# EAGLE design skullbadge_1.1 (EAGLE 5.10)
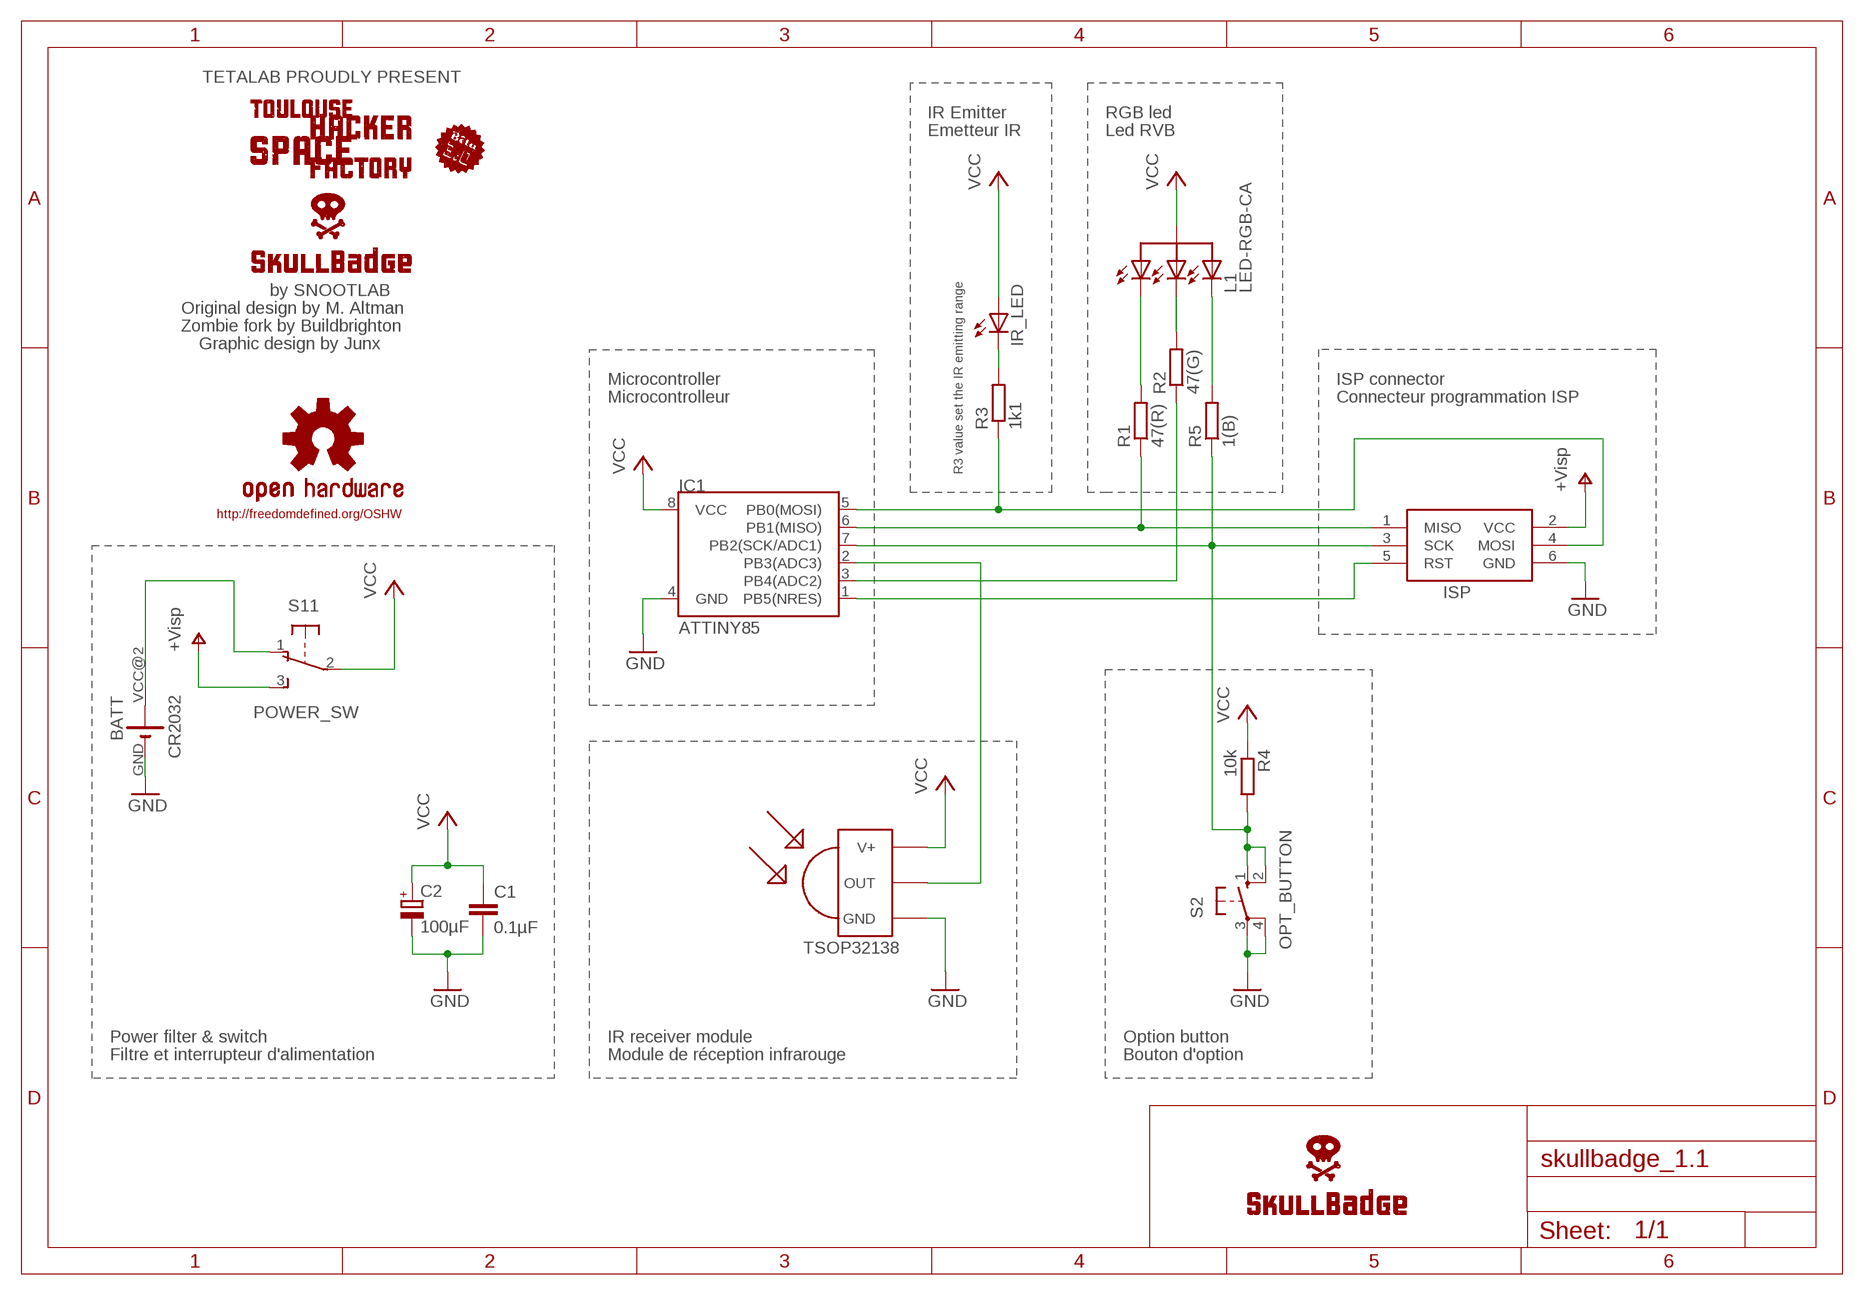
[diagram p0: schematic, sheet 1]

## Parts
BATT  CR2032  CR2032HCOMPACT  [BATT_CONN_CR2032]
C1  0.1µF  C-EU050-025X075  [C050-025X075]
C2  100µF  CPOL-EUE2-5  [E2-5]
IC1  ATTINY85  ATTINY25-45-85DIP08-LP  [DIL08-LP]
IR1  TSOPxxxxx  TSOP321/323/325  [TSOP321XX]
IR_LED  LED5MM_LP  [LED5MM_LP]
ISP  AVRISP-6  [AVRISP]
L1  LED-RGB-CA  LED-RGB-CA-EMS-5MM-BIS  [LED_RGB5MM_CA_DIFF_BIS]
R1  47(R)  R-EU_0207/7  [0207/7]
R2  47(G)  R-EU_0207/7  [0207/7]
R3  1k1  R-EU_0207/7  [0207/7]
R4  10k  R-EU_0207/7  [0207/7]
R5  1(B)  R-EU_0207/7  [0207/7]
S1  POWER_SW  SLIDING_SWITCH_SPDT-OS102011MA1QN1  [OS102011MA1QN1]
S2  OPT_BUTTON  10-XX  [B3F-10XX]
U$7  OSHW-LOGOL  [OSHW-LOGO-L]

## Nets
GND: BATT.GND(-) C1.2 C2.- IC1.4(GND) IR1.GND ISP.6(GND) S2.3(P) S2.4(P1)
MISO: IC1.6(PB1(MISO)) ISP.1(MISO) R1.1
MOSI: IC1.5(PB0(MOSI)) ISP.4(MOSI) R3.1
N$2: L1.RED_C R1.2
N$3: L1.GREEN_C R2.2
N$4: L1.BLUE_C R5.2
N$9: IC1.3(PB4(ADC2)) R2.1
N$11: IC1.2(PB3(ADC3)) IR1.OUT
N$12: IR_LED.K(C) R3.2
RST: IC1.1(PB5(NRES)) ISP.5(RST)
SCK: IC1.7(PB2(SCK/ADC1)) ISP.3(SCK) R4.2 R5.1 S2.1(S) S2.2(S1)
V+: ISP.2(VCC) S1.3 ; supply symbol labelled +Visp
VBAT: BATT.VCC@2(+) S1.1
VCC: C1.1 C2.+ IC1.8(VCC) IR1.VCC(V+) IR_LED.A L1.COMM_A(A) R4.1 S1.2
Unconnected: BATT.VCC@1(+) S1.MT1(MT) S1.MT2(MT)

## Notes on the sheet
- TETALAB PROUDLY PRESENT
- IR Emitter | RGB led
- Emetteur IR | Led RVB
- by SNOOTLAB
- Original design by M. Altman
- Zombie fork by Buildbrighton
- Graphic design by Junx
- Microcontroller | ISP connector
- Microcontrolleur | Connecteur programmation ISP
- R3 value set the IR emitting range
- http://freedomdefined.org/OSHW
- TSOP32138
- Power filter & switch | IR receiver module | Option button
- Filtre et interrupteur d'alimentation | Module de réception infrarouge | Bouton d'option

## Library data of the parts
BATT = SnootLib:CR2032H: LI BATTERY CR2032
C1 = rcl:C-EU: CAPACITOR, European symbol
C2 = rcl:CPOL-EU: POLARIZED CAPACITOR, European symbol
IC1 = SnootLib:ATTINY25-45-85: Atmel ATTiny25-45-85
IR1 = SnootLib:TSOP: IR Receiver and Demodulator
IR_LED = SnootLib:LED: LED OSRAM: - CHIPLED LG R971, LG N971, LY N971, LG Q971, LY Q971, LO R971, LY R971 LH N974, LH R974 LS Q976, LO Q976, LY Q976 LO Q996 - Hyper CHIPLED LW Q18S LB Q993, LB Q99A, LB R99A - SideLED LS A670, LO A670, LY A670, LG A670, LP A670 LB A673, LV A673, LT A673, LW A673 LH A674 LY A675 LS A676, LA A676, LO A676, LY A676, LW A676 LS A679, LY A679, LG A679 - Hyper Micro SIDELED® LS Y876, LA Y876, LO Y876, LY Y876 LT Y87S - SmartLED LW L88C, LW L88S LB L89C, LB L89S, LG L890 LS L89K, LO L89K, LY L89K LS L896, LA L896, LO L896, LY L896 - TOPLED LS T670, LO T670, LY T670, LG T670, LP T670 LSG T670, LSP T670, LSY T670, LOP T670, LYG T670 LG T671, LOG T671, LSG T671 LB T673, LV T673, LT T673, LW T673 LH T674 LS T676, LA T676, LO T676, LY T676, LB T676, LH T676, LSB T676, LW T676 LB T67C, LV T67C, LT T67C, LS T67K, LO T67K, LY T67K, LW E67C LS E67B, LA E67B, LO E67B, LY E67B, LB E67C, LV E67C, LT E67C LW T67C LS T679, LY T679, LG T679 LS T770, LO T770, LY T770, LG T770, LP T770 LB T773, LV T773, LT T773, LW T773 LH T774 LS E675, LA E675, LY E675, LS T675 LS T776, LA T776, LO T776, LY T776, LB T776 LHGB T686 LT T68C, LB T68C - Hyper Mini TOPLED® LB M676 - Mini TOPLED Santana® LG M470 LS M47K, LO M47K, LY M47K Source: http://www.osram.convergy.de LUXEON: - LUMILED® LXK2-PW12-R00, LXK2-PW12-S00, LXK2-PW14-U00, LXK2-PW14-V00 LXK2-PM12-R00, LXK2-PM12-S00, LXK2-PM14-U00 LXK2-PE12-Q00, LXK2-PE12-R00, LXK2-PE12-S00, LXK2-PE14-T00, LXK2-PE14-U00 LXK2-PB12-K00, LXK2-PB12-L00, LXK2-PB12-M00, LXK2-PB14-N00, LXK2-PB14-P00, LXK2-PB14-Q00 LXK2-PR12-L00, LXK2-PR12-M00, LXK2-PR14-Q00, LXK2-PR14-R00 LXK2-PD12-Q00, LXK2-PD12-R00, LXK2-PD12-S00 LXK2-PH12-R00, LXK2-PH12-S00 LXK2-PL12-P00, LXK2-PL12-Q00, LXK2-PL12-R00 Source: www.luxeon.com KINGBRIGHT: KA-3528ASYC Source: www.kingbright.com
ISP = adafruit:AVRISP: AVR ISP HEADER Standard 6 pin header for AVR programming
L1 = SnootLib:LED-RGB-CA: RGB-LED
R1-R5 = resistor:R-EU_: RESISTOR, European symbol
S1 = SnootLib:SLIDING_SWITCH_SPDT: Sliding Switch right-angle SPDT
S2 = switch-omron:10-XX: OMRON SWITCH
U$7 = SparkFun:OSHW-LOGO: Open Source Hardware Logo This logo indicates the piece of hardware it is found on incorporates a OSHW license and/or adheres to the definition of open source hardware found here: http://freedomdefined.org/OSHW

## Board
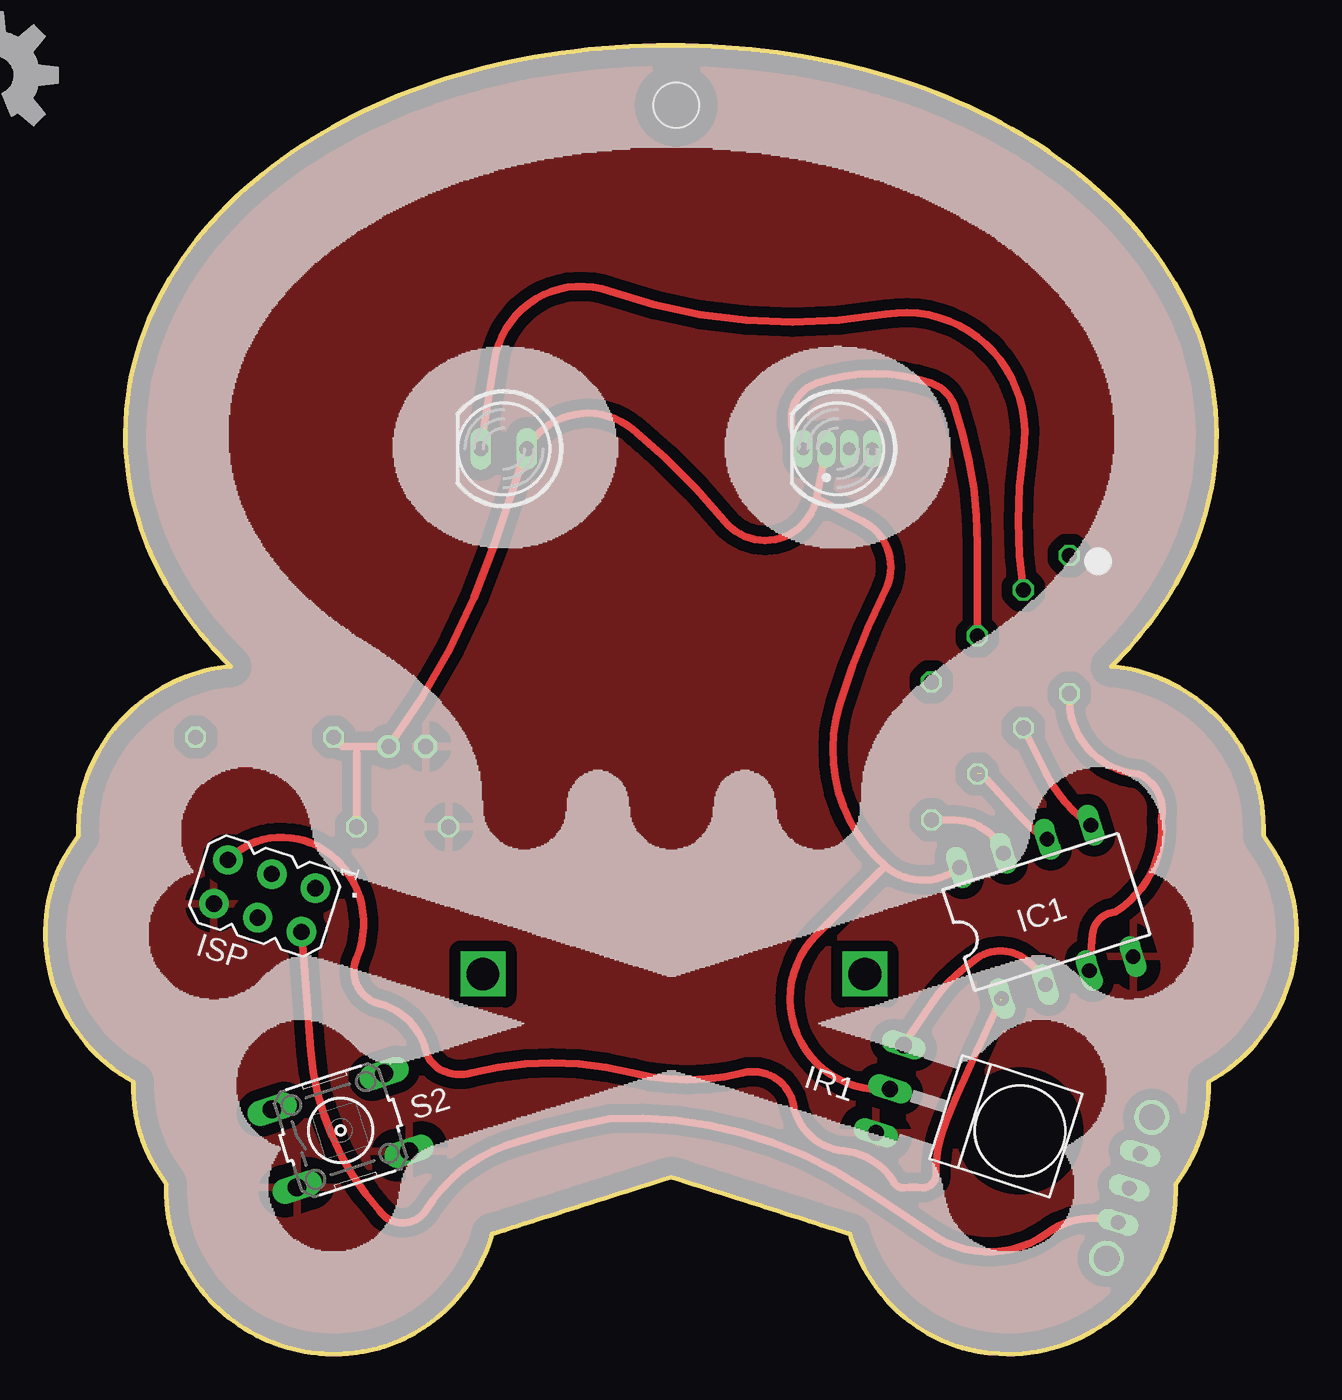
[diagram p1: board, top side]
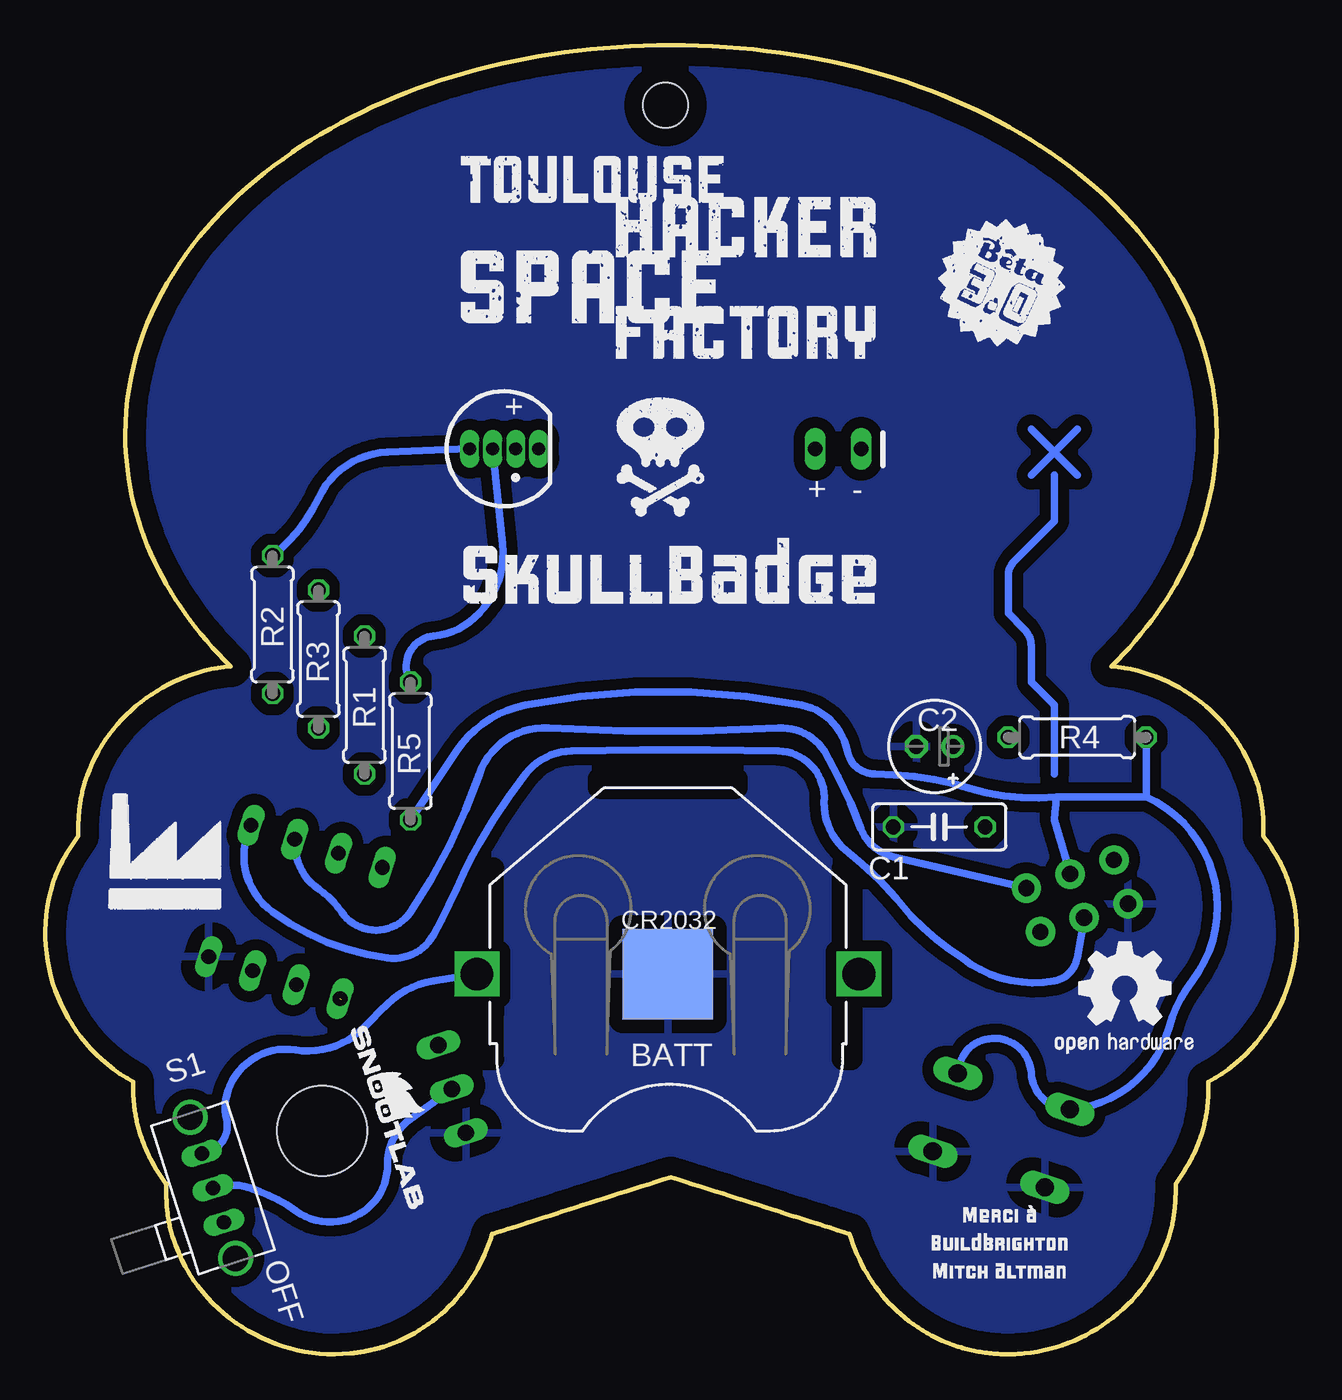
[diagram p2: board, bottom side, seen from below]

Size 69.13 x 72.31 mm. Coordinates in mm from the lower left corner, seen from the top.
Outline: 2.2,31.6 2.21,31.6 2.21,31.6 2.33,31.96 2.46,32.31 2.61,32.65 2.78,32.98 2.95,33.31 3.14,33.62 3.34,33.93 3.54,34.23 3.77,34.51 4,34.79 4.24,35.06 4.49,35.32 4.75,35.57 5.02,35.81 5.3,36.03 5.59,36.25 5.88,36.45 6.18,36.65 6.49,36.83 6.81,37 7.13,37.16 7.45,37.3 7.79,37.43 8.12,37.56 8.47,37.66 8.81,37.76 9.16,37.84 9.52,37.91 9.87,37.96 10.23,38 9.89,38.35 9.55,38.7 9.23,39.05 8.91,39.42 8.6,39.79 8.29,40.16 8,40.54 7.72,40.93 7.45,41.32 7.18,41.72 6.93,42.13 6.69,42.54 6.45,42.96 6.23,43.38 6.02,43.81 5.83,44.24 5.64,44.68 5.47,45.12 5.3,45.57 5.15,46.02 5.02,46.48 4.9,46.95 4.79,47.42 4.69,47.89 4.61,48.37 4.54,48.85 4.49,49.33 4.45,49.82 4.43,50.32 4.42,50.82 4.43,51.49 4.48,52.15 4.54,52.81 4.64,53.45 4.76,54.09 4.9,54.72 5.07,55.34 5.26,55.95 5.48,56.56 5.72,57.15 5.98,57.74 6.26,58.31 6.56,58.88 6.88,59.43 7.22,59.98 7.58,60.51 7.96,61.03 8.35,61.55 8.76,62.05 9.18,62.54 9.63,63.01 10.08,63.48 10.55,63.94 11.03,64.38 11.53,64.81 12.04,65.23 12.56,65.63 13.09,66.02 13.62,66.4 14.17,66.76 14.73,67.12 15.3,67.46 15.88,67.79 16.47,68.11 17.07,68.42 17.68,68.72 18.29,69 18.92,69.28 19.56,69.54 20.2,69.79 20.85,70.03 21.51,70.26 22.18,70.48 22.86,70.69 23.54,70.88 24.23,71.06 24.93,71.23 25.64,71.39 26.35,71.54 27.07,71.67 27.79,71.79 28.52,71.9 29.26,71.99 30.01,72.08 30.75,72.15 31.51,72.21 32.27,72.25 33.03,72.29 33.8,72.31 34.57,72.31 35.32,72.31 36.07,72.29 36.81,72.26 37.55,72.21 38.28,72.16 39.01,72.09 39.73,72.01 40.45,71.92 41.16,71.82 41.87,71.7 42.57,71.58 43.26,71.44 43.95,71.29 44.63,71.13 45.3,70.96 45.97,70.77 46.63,70.58 47.28,70.37 47.93,70.15 48.56,69.93 49.19,69.69 49.81,69.44 50.43,69.18 51.03,68.9 51.63,68.62 52.22,68.33 52.8,68.03 53.37,67.71 53.93,67.39 54.48,67.06 54.5,67.05 54.51,67.04 54.53,67.03 54.54,67.02 54.56,67.01 54.58,67 54.59,66.99 54.61,66.98 54.62,66.97 54.64,66.96 54.66,66.95 54.67,66.94 54.69,66.93 54.7,66.93 54.72,66.92 54.74,66.91 54.75,66.9 54.77,66.89 54.78,66.88 54.8,66.87 54.82,66.86 54.83,66.85 54.85,66.84 54.86,66.83 54.88,66.82 54.89,66.81 54.91,66.8 54.92,66.79 54.94,66.77 54.96,66.76 54.97,66.75 54.99,66.74 55,66.73 55.02,66.72 55.04,66.71 55.05,66.7 55.07,66.69 55.08,66.68 55.1,66.67 55.11,66.66 55.13,66.65 55.15,66.64 55.16,66.63 55.18,66.62 55.19,66.61 55.21,66.6 55.22,66.59 55.24,66.58 55.26,66.57 55.27,66.56 55.29,66.55 55.3,66.54 55.32,66.52 55.33,66.51 55.35,66.5 55.36,66.49 55.38,66.48 55.39,66.47 55.41,66.46 55.42,66.45 55.42,66.45 55.43,66.44 55.43,66.44 55.43,66.44 55.43,66.44 55.43,66.44 55.44,66.44 55.44,66.43 55.44,66.43 55.44,66.43 55.44,66.43 55.44,66.43 55.45,66.42 55.45,66.42 55.45,66.42 55.45,66.42 55.45,66.42 55.45,66.41 55.46,66.41 55.46,66.41 55.46,66.41 55.46,66.41 55.46,66.41 55.46,66.4 55.47,66.4 55.47,66.4 55.47,66.4 55.47,66.4 55.47,66.4 55.48,66.39 56,66.03 56.51,65.65 57.02,65.26 57.51,64.86 57.99,64.44 58.46,64.02 58.92,63.58 59.37,63.13 59.8,62.68 60.22,62.21 60.62,61.73 61.01,61.23 61.38,60.73 61.73,60.22 62.07,59.7 62.39,59.17 62.7,58.63 62.98,58.08 63.24,57.52 63.49,56.95 63.71,56.38 63.92,55.79 64.1,55.2 64.26,54.59 64.39,53.98 64.5,53.37 64.59,52.74 64.66,52.11 64.7,51.47 64.71,50.82 64.7,50.32 64.68,49.83 64.64,49.33 64.59,48.85 64.52,48.37 64.44,47.89 64.34,47.42 64.23,46.95 64.11,46.48 63.98,46.03 63.83,45.57 63.67,45.12 63.49,44.68 63.31,44.24 63.11,43.81 62.9,43.38 62.68,42.96 62.45,42.54 62.2,42.13 61.95,41.73 61.69,41.33 61.41,40.93 61.13,40.54 60.84,40.16 60.54,39.79 60.22,39.42 59.91,39.05 59.58,38.7 59.24,38.35 58.9,38 59.26,37.96 59.61,37.91 59.97,37.84 60.32,37.76 60.67,37.66 61.01,37.56 61.35,37.44 61.68,37.3 62.01,37.16 62.33,37 62.65,36.83 62.96,36.65 63.26,36.45 63.55,36.25 63.84,36.03 64.12,35.81 64.39,35.57 64.65,35.32 64.9,35.06 65.15,34.8 65.38,34.52 65.6,34.23 65.81,33.93 66.01,33.62 66.2,33.31 66.37,32.98 66.53,32.65 66.68,32.31 66.82,31.96 66.94,31.6 66.94,31.6 66.94,31.6
Outline: 2.2,31.6 2.2,31.6
Outline: 2.2,31.6 2.2,31.6
Outline: 2.2,31.6 2.2,31.6
Outline: 2.2,31.6 2.2,31.6 2.2,31.6 2.2,31.6 2.2,31.6
Outline: 2.2,31.6 2.2,31.6
Outline: 2.2,31.6 2.2,31.59
Outline: 2.2,31.59 2.2,31.59
Outline: 2.2,31.59 2.2,31.59 2.2,31.59
Outline: 2.2,31.59 2.2,31.59
Outline: 2.2,31.59 2.2,31.59
Outline: 2.2,31.59 2.2,31.59
Outline: 2.2,31.59 2.2,31.59
Outline: 2.2,31.59 2.2,31.59
Outline: 2.2,31.59 2.19,31.59 2.19,31.59
Outline: 2.19,31.59 2.19,31.59
Outline: 2.19,31.59 2.19,31.59 2.19,31.59 2.19,31.59 2.19,31.59
Outline: 2.19,31.59 2.19,31.59
Outline: 2.19,31.59 2.19,31.58
Outline: 2.19,31.58 2.19,31.58
Outline: 2.19,31.58 2.19,31.58 2.16,31.49 2.13,31.39 2.1,31.29 2.08,31.19 2.05,31.09 2.03,31 2.01,30.9 1.99,30.8 1.97,30.7 1.96,30.6 1.94,30.5 1.93,30.4 1.91,30.31 1.9,30.21 1.89,30.11 1.88,30.01 1.87,29.91 1.86,29.81 1.86,29.71 1.85,29.62 1.84,29.52 1.84,29.42 1.84,29.32 1.83,29.22 1.83,29.12 1.83,29.02 1.83,28.92 1.83,28.83 1.83,28.73 1.84,28.63 1.78,28.55 1.72,28.47 1.66,28.39 1.61,28.31 1.55,28.23 1.49,28.15 1.44,28.06 1.39,27.98 1.33,27.9 1.28,27.81 1.23,27.73 1.18,27.65 1.13,27.56 1.08,27.47 1.03,27.39 0.98,27.3 0.93,27.21 0.89,27.12 0.84,27.03 0.8,26.94 0.76,26.85 0.72,26.76 0.67,26.67 0.64,26.58 0.6,26.48 0.56,26.39 0.52,26.29 0.49,26.2 0.46,26.1 0.42,26
Outline: 0.42,26 0.42,26
Outline: 0.42,26 0.42,26 0.42,26
Outline: 0.42,26 0.42,26
Outline: 0.42,26 0.42,26
Outline: 0.42,26 0.42,26 0.42,26
Outline: 0.42,26 0.42,26
Outline: 0.42,26 0.42,26 0.42,26
Outline: 0.42,26 0.42,26
Outline: 0.42,26 0.42,26
Outline: 0.42,26 0.42,26 0.42,26
Outline: 0.42,26 0.42,26
Outline: 0.42,26 0.42,26 0.42,26
Outline: 0.42,26 0.42,26
Outline: 0.42,26 0.42,26 0.42,25.99
Outline: 0.42,25.99 0.42,25.99
Outline: 0.42,25.99 0.42,25.99
Outline: 0.42,25.99 0.42,25.99 0.42,25.99
Outline: 0.42,25.99 0.42,25.99
Outline: 0.42,25.99 0.42,25.99 0.42,25.99
Outline: 0.42,25.99 0.42,25.99
Outline: 0.42,25.99 0.42,25.99
Outline: 0.42,25.99 0.42,25.99 0.29,25.57 0.19,25.14 0.11,24.71 0.05,24.28 0.02,23.85 0,23.42 0,23 0.03,22.57 0.07,22.15 0.13,21.73 0.21,21.31 0.31,20.9 0.43,20.5 0.56,20.1 0.71,19.7 0.88,19.32 1.07,18.94 1.27,18.57 1.49,18.21 1.73,17.86 1.98,17.52 2.24,17.19 2.52,16.88 2.82,16.57 3.13,16.28 3.45,16 3.78,15.74 4.13,15.49 4.5,15.26 4.87,15.05 4.87,14.95 4.87,14.85 4.87,14.75 4.87,14.65 4.87,14.55 4.87,14.45 4.87,14.35 4.88,14.25 4.89,14.15 4.89,14.05 4.9,13.95 4.91,13.85 4.92,13.75 4.93,13.66 4.95,13.56 4.96,13.46 4.97,13.36 4.99,13.26 5.01,13.16 5.03,13.06 5.05,12.96 5.07,12.86 5.09,12.76 5.11,12.66 5.14,12.56 5.16,12.46 5.19,12.36 5.22,12.26 5.24,12.16 5.28,12.07 5.28,12.07 5.28,12.06 5.28,12.06
Outline: 5.28,12.06 5.28,12.06
Outline: 5.28,12.06 5.28,12.06 5.28,12.06 5.28,12.06 5.28,12.06
Outline: 5.28,12.06 5.28,12.06
Outline: 5.28,12.06 5.28,12.06 5.28,12.06 5.28,12.06 5.28,12.06 5.28,12.06 5.28,12.06 5.28,12.06 5.29,12.06 5.29,12.06 5.29,12.06 5.29,12.05 5.29,12.05 5.29,12.05
Outline: 5.29,12.05 5.29,12.05
Outline: 5.29,12.05 5.29,12.05 5.29,12.05 5.29,12.05 5.29,12.05 5.29,12.05 5.29,12.05 5.29,12.05 5.29,12.05 5.29,12.05
Outline: 5.29,12.05 5.29,12.05
Outline: 5.29,12.05 5.29,12.05
Outline: 5.29,12.05 5.29,12.05
Outline: 5.29,12.05 5.29,12.05
Outline: 5.29,12.05 5.29,12.05
Outline: 5.29,12.05 5.29,12.05
Outline: 5.29,12.05 5.29,12.05
Outline: 5.29,12.05 5.29,12.05
Outline: 5.29,12.05 5.29,12.05
Outline: 5.29,12.05 5.29,12.04
Outline: 5.29,12.04 5.29,12.04
Outline: 5.29,12.04 5.29,12.04
Outline: 5.29,12.04 5.29,12.04
Outline: 5.29,12.04 5.29,12.04
Outline: 5.29,12.04 5.29,12.04
Outline: 5.29,12.04 5.29,12.04
Outline: 5.29,12.04 5.29,12.04
Outline: 5.29,12.04 5.29,12.04
Outline: 5.29,12.04 5.29,12.04
Outline: 5.29,12.04 5.29,12.04
Outline: 5.29,12.04 5.29,12.04
Outline: 5.29,12.04 5.29,12.04
Outline: 5.29,12.04 5.29,12.04
Outline: 5.29,12.04 5.29,12.04
Outline: 5.29,12.04 5.29,12.04
Outline: 5.29,12.04 5.29,12.04
Outline: 5.29,12.04 5.29,12.04
Outline: 5.29,12.04 5.29,12.04 5.32,11.94 5.36,11.85 5.39,11.75 5.43,11.66 5.46,11.56 5.5,11.47 5.54,11.38 5.58,11.28 5.62,11.19 5.66,11.1 5.71,11.01 5.75,10.92 5.79,10.83 5.84,10.75 5.89,10.66 5.94,10.57 5.98,10.49 6.03,10.4 6.08,10.32 6.14,10.23 6.19,10.15 6.24,10.07 6.29,9.98 6.35,9.9 6.4,9.82 6.46,9.74 6.51,9.66 6.57,9.58 6.63,9.5 6.69,9.42 6.68,9.32 6.68,9.22 6.68,9.12 6.68,9.03 6.68,8.93 6.69,8.83 6.69,8.73 6.69,8.63 6.7,8.53 6.7,8.43 6.71,8.33 6.72,8.24 6.73,8.14 6.74,8.04 6.75,7.94 6.76,7.84 6.77,7.74 6.79,7.64 6.8,7.54 6.82,7.44 6.84,7.34 6.86,7.25 6.88,7.15 6.9,7.05 6.92,6.95 6.95,6.85 6.97,6.75 7,6.65 7.03,6.56 7.06,6.46 7.06,6.46 7.06,6.46
Outline: 7.06,6.46 7.06,6.46
Outline: 7.06,6.46 7.06,6.45 7.06,6.45 7.06,6.45 7.06,6.45 7.06,6.45 7.06,6.45
Outline: 7.06,6.45 7.06,6.45
Outline: 7.06,6.45 7.06,6.45 7.06,6.45
Outline: 7.06,6.45 7.06,6.45
Outline: 7.06,6.45 7.06,6.45
Outline: 7.06,6.45 7.06,6.45
Outline: 7.06,6.45 7.06,6.45 7.06,6.45 7.06,6.45 7.06,6.45
Outline: 7.06,6.45 7.06,6.45
Outline: 7.06,6.45 7.06,6.44 7.06,6.44
Outline: 7.06,6.44 7.06,6.44
Outline: 7.06,6.44 7.06,6.44 7.06,6.44 7.06,6.44
Outline: 7.06,6.44 7.06,6.44
Outline: 7.06,6.44 7.07,6.44 7.07,6.44
Outline: 7.07,6.44 7.07,6.44
Outline: 7.07,6.44 7.19,6.08 7.32,5.73 7.47,5.39 7.63,5.06 7.81,4.74 7.99,4.43 8.19,4.12 8.4,3.82 8.62,3.54 8.85,3.26 9.09,2.99 9.34,2.74 9.6,2.49 9.87,2.25 10.14,2.03 10.43,1.81 10.72,1.61 11.02,1.41 11.33,1.23 11.64,1.06 11.96,0.9 12.28,0.76 12.62,0.62 12.95,0.5 13.29,0.39 13.64,0.3 13.98,0.21 14.34,0.14 14.69,0.09 15.05,0.05 15.17,0.03 15.29,0.02 15.41,0.02 15.53,0.01 15.65,0.01 15.77,0 15.89,0 16.01,0 16.13,0 16.25,0 16.37,0.01 16.5,0.02 16.62,0.02 16.74,0.03 16.86,0.04 16.98,0.06 17.1,0.07 17.23,0.09 17.35,0.11 17.47,0.13 17.59,0.15 17.71,0.17 17.83,0.19 17.96,0.22 18.08,0.25 18.2,0.28 18.32,0.31 18.44,0.34 18.56,0.38 18.68,0.42 18.68,0.42 18.68,0.42 18.68,0.42 18.69,0.42 18.69,0.42 18.69,0.42 18.69,0.42 18.69,0.42 18.69,0.42 18.69,0.42 18.69,0.42 18.69,0.42 18.7,0.42 18.7,0.42 18.7,0.42 18.7,0.42 18.7,0.42 18.7,0.42 18.7,0.42 18.7,0.42 18.71,0.42 18.71,0.42 18.71,0.42 18.71,0.42 18.71,0.42 18.71,0.42 18.71,0.42 18.71,0.42 18.71,0.42 18.72,0.42 19.01,0.53 19.3,0.64 19.59,0.76 19.87,0.88 20.14,1.02 20.41,1.17 20.67,1.32 20.92,1.48 21.17,1.65 21.41,1.83 21.64,2.02 21.87,2.21 22.09,2.41 22.3,2.61 22.51,2.83 22.71,3.05 22.9,3.27 23.09,3.5 23.26,3.74 23.43,3.98 23.6,4.23 23.75,4.48 23.9,4.73 24.03,4.99 24.17,5.26 24.29,5.53 24.4,5.8 24.51,6.08 24.61,6.36 24.7,6.64 24.83,6.69 24.99,6.73 25.17,6.79 25.36,6.85 25.58,6.92 25.82,7 26.07,7.08 26.34,7.16 26.62,7.25 26.92,7.35 27.24,7.45 27.56,7.55 27.9,7.66 28.25,7.77 28.61,7.89 28.97,8 29.35,8.12 29.73,8.24 30.12,8.37 30.52,8.49 30.92,8.62 31.32,8.75 31.73,8.88 32.13,9.01 32.54,9.14 32.95,9.27 33.36,9.4 33.77,9.53 34.17,9.65 34.57,9.78 34.97,9.65 35.38,9.53 35.79,9.4 36.19,9.27 36.6,9.14 37.01,9.01 37.42,8.88 37.83,8.75 38.23,8.62 38.63,8.49 39.03,8.37 39.42,8.24 39.8,8.12 40.17,8 40.54,7.88 40.9,7.77 41.25,7.66 41.59,7.55 41.91,7.45 42.23,7.35 42.52,7.25 42.81,7.16 43.08,7.08 43.33,7 43.57,6.92 43.78,6.85 43.98,6.79 44.16,6.73 44.32,6.68 44.45,6.64 44.54,6.36 44.64,6.08 44.74,5.8 44.86,5.53 44.98,5.26 45.11,4.99 45.25,4.73 45.4,4.48 45.55,4.23 45.71,3.98 45.88,3.74 46.06,3.5 46.24,3.27 46.43,3.05 46.63,2.83 46.84,2.61 47.05,2.41 47.27,2.21 47.5,2.02 47.73,1.83 47.97,1.65 48.22,1.48 48.47,1.32 48.73,1.17 49,1.02 49.27,0.88 49.55,0.76 49.84,0.64 50.13,0.53 50.42,0.42 50.42,0.42 50.42,0.42 50.43,0.42 50.43,0.42 50.43,0.42 50.43,0.42 50.43,0.42 50.43,0.42 50.43,0.42 50.43,0.42 50.43,0.42 50.44,0.42 50.44,0.42 50.44,0.42 50.44,0.42 50.44,0.42 50.44,0.42 50.44,0.42 50.44,0.42 50.45,0.42 50.45,0.42 50.45,0.42 50.45,0.42 50.45,0.42 50.45,0.42 50.45,0.42 50.45,0.42 50.46,0.42 50.46,0.42 50.46,0.42 50.52,0.4 50.58,0.38 50.64,0.36 50.7,0.34 50.76,0.33 50.82,0.31 50.88,0.29 50.94,0.28 51,0.26 51.06,0.25 51.12,0.23 51.18,0.22 51.24,0.21 51.3,0.19 51.36,0.18 51.42,0.17 51.48,0.16 51.55,0.15 51.61,0.14 51.67,0.13 51.73,0.12 51.79,0.11 51.85,0.1 51.91,0.09 51.97,0.08 52.03,0.07 52.09,0.07 52.15,0.06 52.21,0.05 52.27,0.05 52.7,0.01 53.12,0 53.55,0.01 53.97,0.03 54.38,0.08 54.8,0.14 55.21,0.23 55.61,0.33 56.01,0.45 56.41,0.58 56.79,0.73 57.17,0.9 57.55,1.09 57.91,1.29 58.27,1.51 58.61,1.74 58.95,1.99 59.27,2.25 59.58,2.53 59.88,2.82 60.17,3.13 60.44,3.44 60.7,3.78 60.95,4.12 61.18,4.48 61.39,4.85 61.59,5.23 61.77,5.62 61.93,6.02 62.07,6.44 62.07,6.44 62.07,6.44 62.07,6.44
Outline: 62.07,6.44 62.07,6.44
Outline: 62.07,6.44 62.08,6.44 62.08,6.44 62.08,6.44 62.08,6.44 62.08,6.44 62.08,6.45
Outline: 62.08,6.45 62.08,6.45
Outline: 62.08,6.45 62.08,6.45 62.08,6.45 62.08,6.45 62.08,6.45
Outline: 62.08,6.45 62.08,6.45
Outline: 62.08,6.45 62.08,6.45 62.08,6.45 62.08,6.45 62.08,6.45
Outline: 62.08,6.45 62.08,6.45
Outline: 62.08,6.45 62.09,6.45 62.09,6.45 62.09,6.45 62.09,6.45
Outline: 62.09,6.45 62.09,6.45
Outline: 62.09,6.45 62.09,6.46 62.09,6.46 62.09,6.46 62.09,6.46 62.12,6.55 62.15,6.65 62.17,6.75 62.2,6.85 62.22,6.95 62.25,7.04 62.27,7.14 62.29,7.24 62.31,7.34 62.32,7.44 62.34,7.54 62.35,7.63 62.37,7.73 62.38,7.83 62.39,7.93 62.4,8.03 62.41,8.13 62.42,8.22 62.42,8.32 62.43,8.42 62.43,8.52 62.44,8.62 62.44,8.72 62.44,8.81 62.45,8.91 62.45,9.01 62.45,9.11 62.45,9.21 62.44,9.3 62.44,9.4 62.5,9.48 62.56,9.56 62.62,9.64 62.67,9.72 62.73,9.8 62.78,9.89 62.84,9.97 62.89,10.05 62.94,10.14 63,10.22 63.05,10.3 63.1,10.39 63.15,10.48 63.19,10.56 63.24,10.65 63.29,10.74 63.34,10.83 63.38,10.92 63.42,11.01 63.47,11.1 63.51,11.19 63.55,11.28 63.59,11.37 63.63,11.46 63.67,11.56 63.7,11.65 63.74,11.75 63.77,11.84 63.8,11.94 63.84,12.04
Outline: 63.85,12.04 63.89,12.14 63.91,12.24 63.94,12.34 63.97,12.44 64,12.54 64.02,12.64 64.05,12.74 64.07,12.84 64.09,12.94 64.11,13.04 64.13,13.14 64.15,13.24 64.16,13.34 64.18,13.44 64.19,13.54 64.2,13.64 64.22,13.74 64.23,13.84 64.24,13.94 64.24,14.04 64.25,14.15 64.26,14.25 64.26,14.35 64.27,14.45 64.27,14.55 64.27,14.65 64.27,14.75 64.27,14.85 64.27,14.95 64.27,15.05 64.64,15.26 65,15.49 65.35,15.74 65.69,16 66.01,16.28 66.32,16.57 66.61,16.88 66.89,17.19 67.16,17.52 67.41,17.86 67.64,18.21 67.86,18.57 68.06,18.94 68.25,19.32 68.42,19.71 68.57,20.1 68.7,20.5 68.82,20.9 68.92,21.31 69,21.73 69.06,22.15 69.1,22.57 69.13,23 69.13,23.42 69.11,23.85 69.07,24.28 69.02,24.71 68.94,25.14 68.84,25.57 68.71,25.99 68.71,25.99
Outline: 68.71,25.99 68.71,25.99
Outline: 68.71,25.99 68.71,25.99
Outline: 68.71,25.99 68.71,25.99
Outline: 68.71,25.99 68.71,25.99
Outline: 68.71,25.99 68.71,25.99
Outline: 68.71,25.99 68.71,25.99
Outline: 68.71,25.99 68.71,25.99
Outline: 68.71,25.99 68.71,25.99
Outline: 68.71,25.99 68.71,25.99
Outline: 68.71,25.99 68.71,26
Outline: 68.71,26 68.71,26
Outline: 68.71,26 68.71,26
Outline: 68.71,26 68.71,26
Outline: 68.71,26 68.71,26
Outline: 68.71,26 68.71,26
Outline: 68.71,26 68.71,26
Outline: 68.71,26 68.71,26
Outline: 68.71,26 68.71,26
Outline: 68.71,26 68.71,26
Outline: 68.71,26 68.71,26
Outline: 68.71,26 68.71,26
Outline: 68.71,26 68.71,26
Outline: 68.71,26 68.71,26
Outline: 68.71,26 68.71,26
Outline: 68.71,26 68.71,26
Outline: 68.71,26 68.71,26
Outline: 68.71,26 68.71,26
Outline: 68.71,26 68.71,26
Outline: 68.71,26 68.71,26
Outline: 68.71,26 68.68,26.1 68.65,26.2 68.61,26.29 68.58,26.39 68.54,26.48 68.5,26.58 68.46,26.67 68.42,26.76 68.38,26.85 68.34,26.94 68.29,27.03 68.25,27.12 68.2,27.21 68.16,27.3 68.11,27.39 68.06,27.47 68.01,27.56 67.96,27.65 67.91,27.73 67.86,27.81 67.81,27.9 67.75,27.98 67.7,28.06 67.64,28.15 67.59,28.23 67.53,28.31 67.48,28.39 67.42,28.47 67.36,28.55 67.3,28.63 67.3,28.73 67.31,28.83 67.31,28.92 67.31,29.02 67.3,29.12 67.3,29.22 67.3,29.32 67.3,29.42 67.29,29.52 67.29,29.62 67.28,29.71 67.27,29.81 67.26,29.91 67.26,30.01 67.25,30.11 67.23,30.21 67.22,30.31 67.21,30.4 67.19,30.5 67.18,30.6 67.16,30.7 67.14,30.8 67.12,30.9 67.1,31 67.08,31.09 67.05,31.19 67.03,31.29 67,31.39 66.97,31.49 66.94,31.58 66.94,31.58
Outline: 66.94,31.58 66.94,31.58
Outline: 66.94,31.58 66.94,31.59
Outline: 66.94,31.59 66.94,31.59
Outline: 66.94,31.59 66.94,31.59 66.94,31.59
Outline: 66.94,31.59 66.94,31.59
Outline: 66.94,31.59 66.94,31.59
Outline: 66.94,31.59 66.94,31.59
Outline: 66.94,31.59 66.94,31.59 66.94,31.59
Outline: 66.94,31.59 66.94,31.59
Outline: 66.94,31.59 66.94,31.59
Outline: 66.94,31.59 66.94,31.59
Outline: 66.94,31.59 66.94,31.59
Outline: 66.94,31.59 66.94,31.59
Outline: 66.94,31.59 66.94,31.59 66.94,31.59
Outline: 66.94,31.59 66.94,31.59
Outline: 66.94,31.59 66.94,31.6
Outline: 66.94,31.6 66.94,31.6
Outline: 66.94,31.6 66.94,31.6
Outline: 66.94,31.6 66.94,31.6
Outline: 66.94,31.6 66.94,31.6 66.94,31.6
Outline: 66.94,31.6 66.94,31.6
Outline: 66.94,31.6 66.94,31.6
Outline: 66.94,31.6 66.94,31.6
Copper layers (1*16): Top 0.035mm / dielectric 1.5mm / Bottom 0.035mm
Design rules "zombadge_1.2_DRC_snoot": minimum track width 10mil, minimum drill 24mil, track to track 7mil, track to pad 7mil, pad to pad 7mil, via to via 7mil, smd to smd 7mil, copper to edge 40mil, drill to drill 8mil, minimum pad ring 7mil, minimum via ring 8mil, stop-mask expansion 4mil, vias tented up to drill 0mil, thermal gap 30mil
Holes 2.5 mm at 34.86,69.01
Holes 5 mm at 53.83,12.34

### Footprints (pad centres in the part's own frame; a part is rotated, then mirrored left to right if it is on the bottom)
BATT_CONN_CR2032 = smd 5 x 5: GND 0,0 | drill 1.8 square: VCC@1 -10.55,0; VCC@2 10.55,0
C050-025X075 = drill 0.813 octagon: 1 -2.54,0; 2 2.54,0
E2-5 = drill 0.813 pad 1.27 round: + -1.016,0 | drill 0.813 pad 1.27 octagon: - 1.016,0
DIL08-LP = drill 0.813 long: 1 -3.81,-3.81; 2 -1.27,-3.81; 3 1.27,-3.81; 4 3.81,-3.81; 5 3.81,3.81; 6 1.27,3.81; 7 -1.27,3.81; 8 -3.81,3.81
TSOP321XX = drill 0.9 long: GND 2.54,0; OUT -2.54,-0.027; VCC 0,0
LED5MM_LP = drill 0.813 long: A -1.27,0; K 1.27,0
AVRISP = drill 0.9 pad 1.626 round: 1 -1.27,2.54; 2 1.27,2.54; 3 -1.27,0; 4 1.27,0; 5 -1.27,-2.54; 6 1.27,-2.54
LED_RGB5MM_CA_DIFF_BIS = drill 0.7 pad 0.9 long: BLUE_C 0.635,0; COMM_A -0.635,0; GREEN_C 1.905,0; RED_C -1.905,0
0207/7 = drill 0.813 octagon: 1 -3.81,0; 2 3.81,0
OS102011MA1QN1 = drill 0.8 long: 1 -2,0; 2 0,0; 3 2,0 | drill 1.4 pad 1.778 round: MT1 -4.1,0; MT2 4.1,0
B3F-10XX = drill 1.016 long: 1 -3.251,2.261; 2 3.251,2.261; 3 -3.251,-2.261; 4 3.251,-2.261

### Placement (x,y rotation side)
BATT  34.73,21 180 bottom
C1  19.74,29.13 180 bottom
C2  20,33.58 180 bottom
IC1  55.3,24.43 17.8 top
IR1  46.67,14.65 252.2 top
IR_LED  25.33,50.02 180 top
ISP  12.12,25.32 252.2 top
L1  43.78,50.02 0 top
R1  51.49,35.86 90 bottom
R2  56.57,40.31 90 bottom
R3  54.03,38.4 90 bottom
R4  12.12,34.08 0 bottom
R5  48.95,33.32 90 bottom
S1  59.88,9.19 287.8 bottom
S2  16.31,12.37 17.8 top
U$1  [LOGO_OH_FULL_H7]  13.35,16.58 0 bottom
U$3  [LED5MM_EDGE]  43.78,50.02 0 bottom
U$4  [LED5MM_EDGE_200BMP]  25.33,50.02 180 top
U$6  [LED5MM_EDGE_200BMP]  43.78,50.02 180 top
U$7  -2.78,70.66 0 top

### Tracks (layer width: path | path; a pad name or v marks a point on that pad's centre or on a via)
GND
  pour Bottom (isolate 0.61): -8.2,75.23 78.16,75.23 78.16,-14.94 -8.2,-14.94
  pour Top (isolate 0.61): -9.47,76.5 -9.47,-7.32 79.43,-7.32 79.43,76.5
MISO  (1 unrouted)
  Top 0.406: 51.74,32.05 54.03,29.51 arc18 IC1.6
  Bottom 0.406: ISP.1 22.28,27.48 arc54 24.06,29 arc-11 26.09,33.32 arc-60 28.63,34.59 arc7 41.33,34.59 arc-74 45.14,32.05 arc15 48.95,24.43 arc112 52.76,24.43 arc-22 54.03,25.7 arc59 55.3,28.24 arc-30 IC1.6
MOSI
  Top 0.406: R3.1 55.3,32.05 arc29 IC1.5
  Bottom 0.406: ISP.4 12.12,21.89 arc70 13.39,20.62 arc48 18.47,21.89 arc14 21.27,24.18 arc-14 25.08,27.99 arc51 26.09,30.78 arc-88 28.63,33.32 arc-2 40.06,33.32 arc-51 42.6,32.05 arc-9 45.14,28.24 arc-6 46.41,25.7 arc6 47.68,23.16 arc68 50.22,21.89 arc29 56.57,24.43 arc80 IC1.5
N$2
  Top 0.406: R1.2 51.49,44.75 arc19 50.22,52.37 arc52 48.95,53.64 arc38 42.6,53.64 arc52 41.33,52.37 arc64 L1.RED_C
N$3
  Bottom 0.406: L1.GREEN_C 50.22,49.83 arc-63 54.03,47.29 arc27 R2.2
N$4
  Bottom 0.406: L1.BLUE_C 43.87,44.75 arc49 45.14,40.94 arc41 47.68,39.67 arc-115 R5.2
N$5
  Bottom 0.406: 12.12,48.56 14.66,51.1
N$6
  Bottom 0.406: 12.12,51.1 14.66,48.56
N$9
  Top 0.406: IC1.3 57.84,23.16 arc-80 59.11,24.43 arc63 61.65,29.51 arc80 60.38,32.05 arc-89 R2.1
N$11
  Top 0.406: IR1.OUT 48.95,19.35 arc-22 51.49,21.89 arc-68 54.03,21.89 arc-33 IC1.2
N$12
  Top 0.406: IR_LED.K 24.82,54.91 arc-100 31.17,58.72 arc29 46.41,57.45 arc-63 52.76,54.91 arc-45 54.03,49.83 arc17 R3.2
N$13
  Bottom 0.406: 13.39,48.56 13.39,46.02 15.56,43.85 arc-45 15.93,42.96 15.93,40.94 15.04,40.04 arc45 14.66,39.15 14.66,37.13 13.39,35.86 13.39,32.05
RST  (1 unrouted)
  Top 0.406: 52.76,19.56 51.49,16.81 arc2 49.72,12.75 arc24 49.21,9.95 arc-94 48.45,9.19 arc13 47.43,9.19 arc-66 46.92,9.45 arc54 44.13,11.22 arc-74 41.33,13.76 arc93 38.54,15.54 arc-28 32.44,15.54 arc28 23.55,15.54 arc-28 22.28,15.54 arc-62 21.01,16.81 arc62 18.47,19.35 arc-98 17.2,21.89 arc45 17.2,25.7 arc45 14.66,28.24 arc68 ISP.5
SCK
  Top 0.406: R5.1 50.22,29.51 arc-68 IC1.7
  Bottom 0.406: S2.2 arc174 14.66,15.54 arc-87 S2.1 arc-70 7.04,18.08 arc23 5.77,20.62 arc-104 8.31,30.78 | R5.1 46.41,33.32 arc45 42.6,35.86 arc22 27.36,35.86 arc68 24.82,33.32 arc-78 23.3,32.05 arc12 18.98,31.54 arc-25 13.27,30.78 | ISP.3 13.39,29.51 arc-2 13.27,30.78 | 13.27,30.78 10.85,30.78 8.31,30.78 | R4.2 8.31,32.05 8.31,30.78
V+
  Top 0.406: S1.3 arc56 55.3,6.65 arc-70 48.95,6.65 arc2 45.14,9.19 arc37 31.17,13 arc7 26.09,11.73 arc44 21.01,7.92 arc-111 18.47,7.92 arc-37 14.66,16.81 ISP.2
VBAT
  Bottom 0.406: BATT.VCC@2 47.68,20.62 arc-35 50.22,19.35 arc-2 51.49,18.08 arc55 55.3,16.81 arc-85 59.11,14.27 arc-27 59.11,13 arc99 S1.1
VCC
  Top 0.406: 17.2,33.58 16.44,33.58 R4.1 | 17.2,33.58 C2.+ arc18 24.82,44.75 IR_LED.A arc-100 32.44,51.1 arc-11 37.52,46.02 arc129 42.6,47.29 | C1.1 17.2,33.58 | 42.6,47.29 L1.COMM_A | 42.6,47.29 45.14,46.02 arc-90 46.41,42.21 arc10 43.87,35.86 arc66 46.41,26.97 | 46.41,26.97 arc80 IC1.8 | 46.41,26.97 42.6,23.16 arc141 IR1.VCC
  Bottom 0.406: IR1.VCC 48.95,13 arc-55 50.22,10.46 arc55 51.49,7.92 arc72 55.3,7.92 arc-19 57.84,9.19 arc-35 S1.2

### Text on the board
tNames: .
bNames: + | - | + | CR2032 | OFF